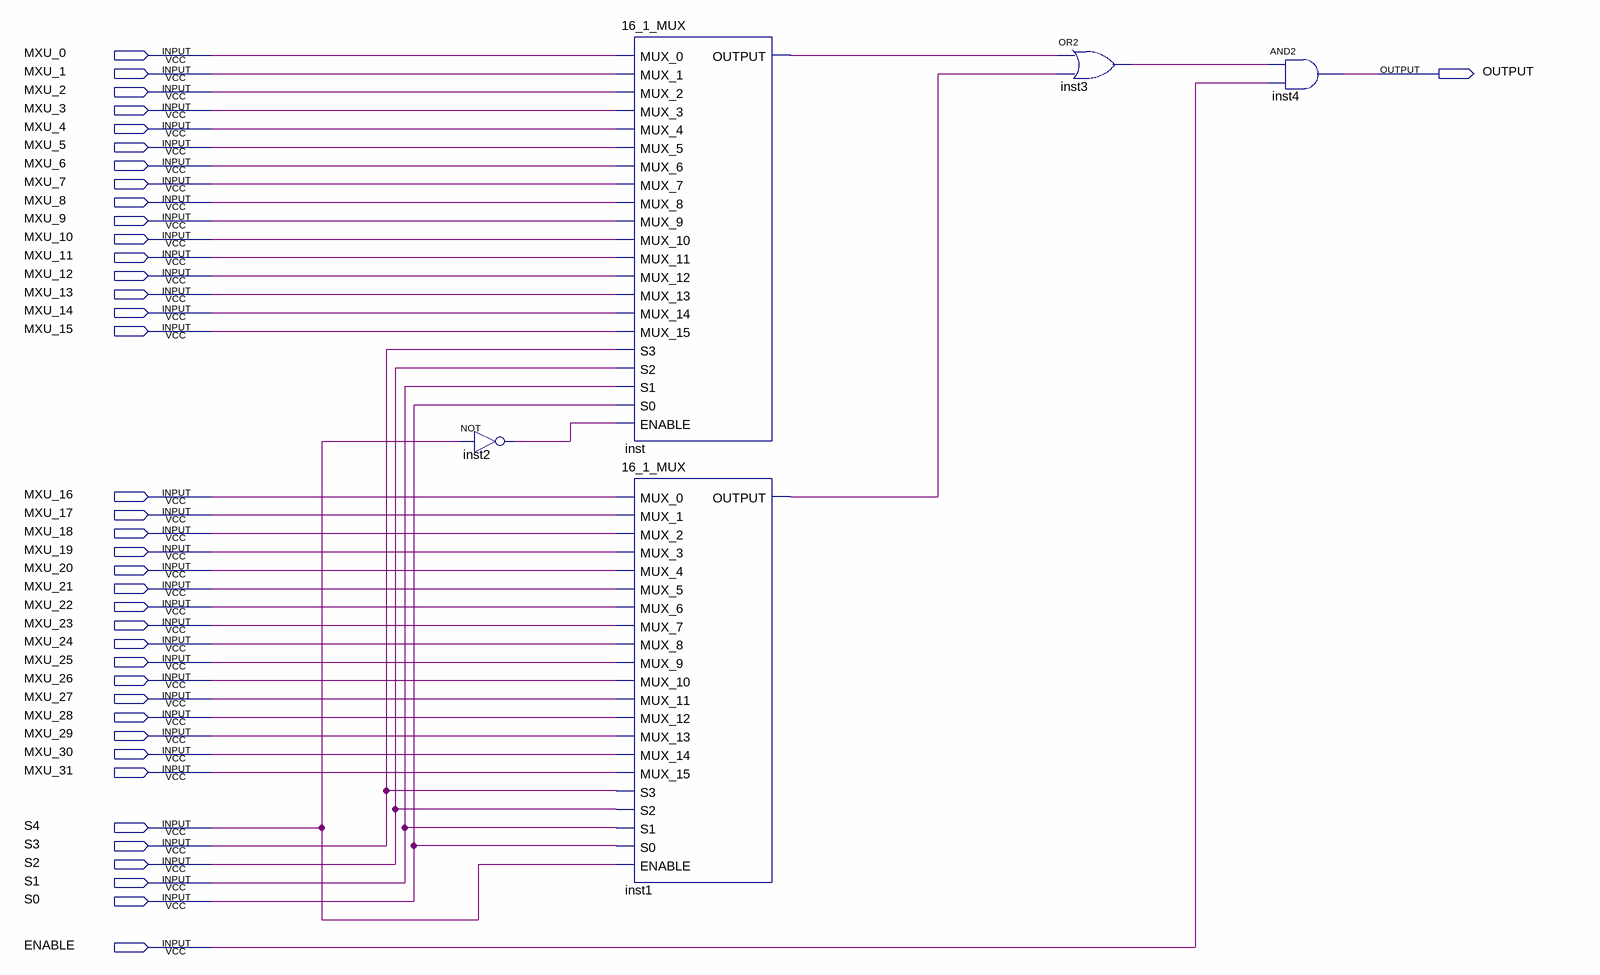
[diagram p0: schematic sheet]
// Quartus schematic 32_1_MUX.bdf as structural Verilog: 5 symbols, 39 pins
module \32_1_MUX  (
  input  MXU_0,
  input  MXU_1,
  input  MXU_2,
  input  MXU_3,
  input  MXU_4,
  input  MXU_5,
  input  MXU_6,
  input  MXU_7,
  input  MXU_8,
  input  MXU_9,
  input  MXU_10,
  input  MXU_11,
  input  MXU_12,
  input  MXU_13,
  input  MXU_14,
  input  MXU_15,
  input  MXU_16,
  input  MXU_17,
  input  MXU_18,
  input  MXU_19,
  input  MXU_20,
  input  MXU_21,
  input  MXU_22,
  input  MXU_23,
  input  MXU_24,
  input  MXU_25,
  input  MXU_26,
  input  MXU_27,
  input  MXU_28,
  input  MXU_29,
  input  MXU_30,
  input  MXU_31,
  input  S4,
  input  S3,
  input  S2,
  input  S1,
  input  S0,
  input  ENABLE,
  output OUTPUT
);

  wire inst1_output, inst2_out, inst3_out, inst_output;

  not inst2 (inst2_out, S4);
  \16_1_MUX  inst (
    .MUX_0(MXU_0), .MUX_1(MXU_1), .MUX_2(MXU_2), .MUX_3(MXU_3), .MUX_4(MXU_4), .MUX_5(MXU_5), .MUX_6(MXU_6),
    .MUX_7(MXU_7), .MUX_8(MXU_8), .MUX_9(MXU_9), .MUX_10(MXU_10), .MUX_11(MXU_11), .MUX_12(MXU_12),
    .MUX_13(MXU_13), .MUX_14(MXU_14), .MUX_15(MXU_15), .S3(S3), .S2(S2), .S1(S1), .S0(S0),
    .ENABLE(inst2_out), .OUTPUT(inst_output));
  \16_1_MUX  inst1 (
    .MUX_0(MXU_16), .MUX_1(MXU_17), .MUX_2(MXU_18), .MUX_3(MXU_19), .MUX_4(MXU_20), .MUX_5(MXU_21),
    .MUX_6(MXU_22), .MUX_7(MXU_23), .MUX_8(MXU_24), .MUX_9(MXU_25), .MUX_10(MXU_26), .MUX_11(MXU_27),
    .MUX_12(MXU_28), .MUX_13(MXU_29), .MUX_14(MXU_30), .MUX_15(MXU_31), .S3(S3), .S2(S2), .S1(S1), .S0(S0),
    .ENABLE(S4), .OUTPUT(inst1_output));
  or inst3 (inst3_out, inst_output, inst1_output);
  and inst4 (OUTPUT, inst3_out, ENABLE);
endmodule
